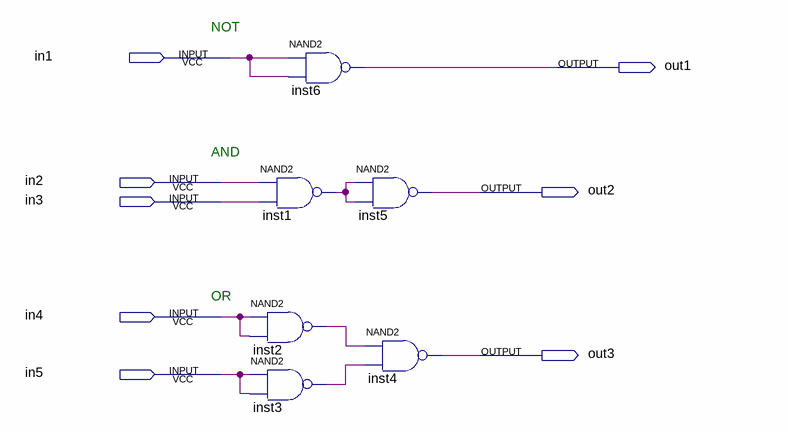
[diagram p0: schematic sheet]
// Quartus schematic Univer_Portas_NAND.bdf as structural Verilog: 6 symbols, 8 pins
module Univer_Portas_NAND (
  input  in1,
  input  in2,
  input  in3,
  input  in4,
  input  in5,
  output out1,
  output out2,
  output out3
);

  wire inst1_out, inst2_out, inst3_out;

  nand inst6 (out1, in1, in1);
  nand inst1 (inst1_out, in2, in3);
  nand inst2 (inst2_out, in4, in4);
  nand inst3 (inst3_out, in5, in5);
  nand inst5 (out2, inst1_out, inst1_out);
  nand inst4 (out3, inst2_out, inst3_out);

  // Notes on the sheet:
  //   NOT
  //   AND
  //   OR
endmodule
